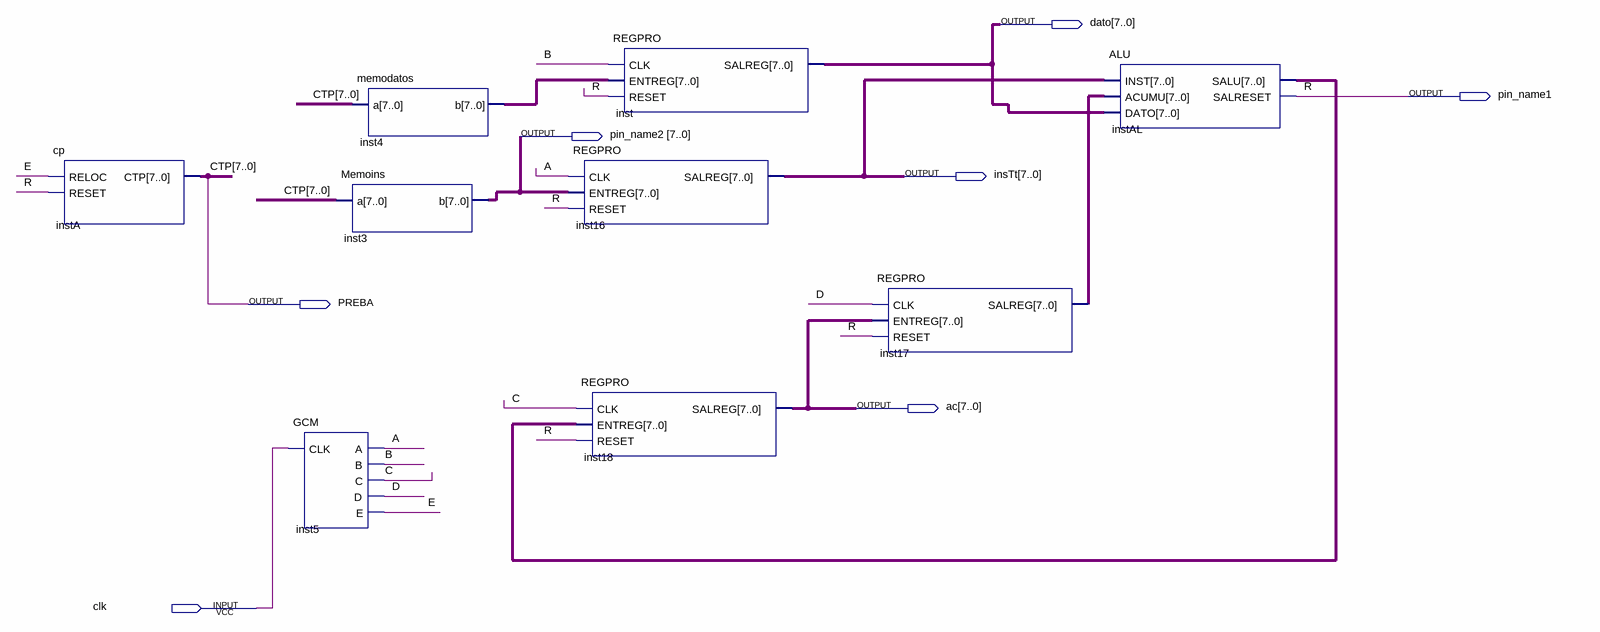
[diagram p0: schematic sheet]
// Quartus schematic Procesador.bdf as structural Verilog: 9 symbols, 7 pins
module Procesador (
  input  clk,
  output [7:0] dato,
  output pin_name1,
  output [7:0] pin_name2,
  output [7:0] insTt,
  output PREBA,
  output [7:0] ac
);

  wire A, B, C, D, E;
  wire [7:0] CTP, inst4_b, inst17_salreg, instAL_salu;

  cp instA (.RELOC(E), .RESET(pin_name1), .CTP(CTP));
  GCM inst5 (.CLK(clk), .A(A), .B(B), .C(C), .D(D), .E(E));
  memodatos inst4 (.a(CTP), .b(inst4_b));
  Memoins inst3 (.a(CTP), .b(pin_name2));
  REGPRO inst (.CLK(B), .ENTREG(inst4_b), .RESET(pin_name1), .SALREG(dato));
  REGPRO inst16 (.CLK(A), .ENTREG(pin_name2), .RESET(pin_name1), .SALREG(insTt));
  REGPRO inst18 (.CLK(C), .ENTREG(instAL_salu), .RESET(pin_name1), .SALREG(ac));
  REGPRO inst17 (.CLK(D), .ENTREG(ac), .RESET(pin_name1), .SALREG(inst17_salreg));
  ALU instAL (.INST(insTt), .ACUMU(inst17_salreg), .DATO(dato), .SALU(instAL_salu), .SALRESET(pin_name1));

  // Other names for the same wires on the sheet: R = pin_name1
endmodule
